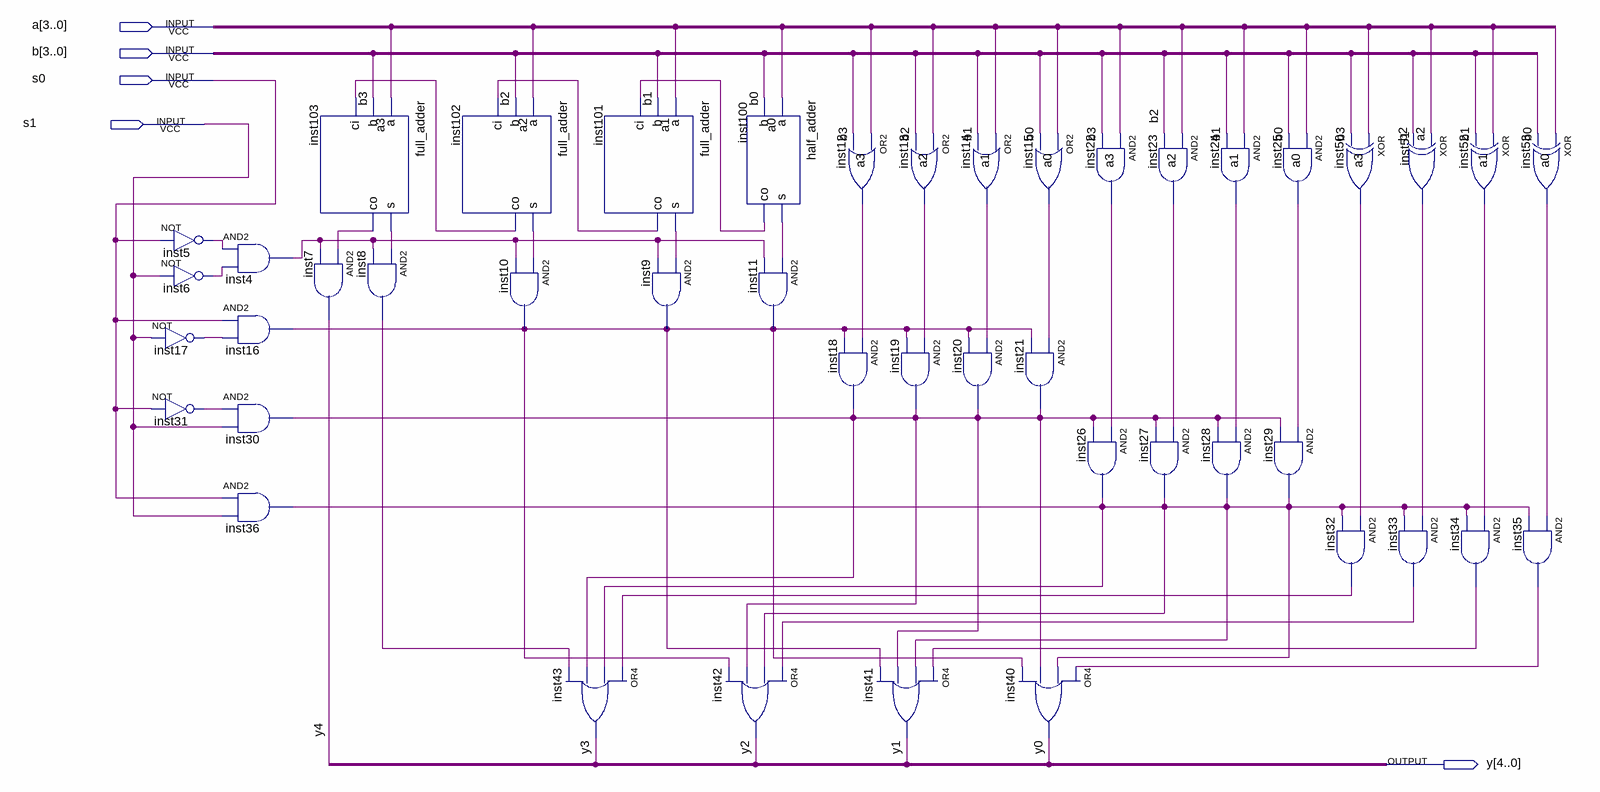
[diagram p0: schematic sheet]
// Quartus schematic simpleALU_BDF.bdf as structural Verilog: 45 symbols, 5 pins
module simpleALU_BDF (
  input  [3:0] a,
  input  [3:0] b,
  input  s0,
  input  s1,
  output [4:0] y
);

  wire inst4_out, inst5_out, inst6_out, inst8_out, inst12_out, inst13_out, inst14_out, inst15_out,
       inst16_out, inst17_out, inst22_out, inst23_out, inst24_out, inst25_out, inst30_out, inst31_out,
       inst32_out, inst33_out, inst34_out, inst35_out, inst36_out, inst50_out, inst51_out, inst52_out,
       inst53_out, inst100_co, inst100_s, inst101_co, inst101_s, inst102_co, inst102_s, inst103_co, inst103_s;

  not inst5 (inst5_out, s0);
  not inst6 (inst6_out, s1);
  not inst17 (inst17_out, s1);
  not inst31 (inst31_out, s0);
  and inst4 (inst4_out, inst5_out, inst6_out);
  and inst16 (inst16_out, s0, inst17_out);
  and inst30 (inst30_out, inst31_out, s1);
  and inst36 (inst36_out, s0, s1);
  full_adder inst103 (.a(a[3]), .b(b[3]), .ci(inst102_co), .s(inst103_s), .co(inst103_co));
  and inst7 (y[4], inst103_co, inst4_out);
  and inst8 (inst8_out, inst103_s, inst4_out);
  full_adder inst102 (.a(a[2]), .b(b[2]), .ci(inst101_co), .s(inst102_s), .co(inst102_co));
  and inst10 (inst16_out, inst102_s, inst4_out);
  or inst43 (y[3], inst32_out, inst36_out, inst30_out, inst8_out);
  full_adder inst101 (.a(a[1]), .b(b[1]), .ci(inst100_co), .s(inst101_s), .co(inst101_co));
  and inst9 (inst16_out, inst101_s, inst4_out);
  half_adder inst100 (.a(a[0]), .b(b[0]), .s(inst100_s), .co(inst100_co));
  and inst11 (inst16_out, inst100_s, inst4_out);
  or inst42 (y[2], inst33_out, inst36_out, inst30_out, inst16_out);
  or inst12 (inst12_out, a[3], b[3]);
  and inst18 (inst30_out, inst12_out, inst16_out);
  or inst13 (inst13_out, a[2], b[2]);
  and inst19 (inst30_out, inst13_out, inst16_out);
  or inst41 (y[1], inst34_out, inst36_out, inst30_out, inst16_out);
  or inst14 (inst14_out, a[1], b[1]);
  and inst20 (inst30_out, inst14_out, inst16_out);
  or inst15 (inst15_out, a[0], b[0]);
  and inst21 (inst30_out, inst15_out, inst16_out);
  or inst40 (y[0], inst35_out, inst36_out, inst30_out, inst16_out);
  and inst22 (inst22_out, a[3], b[3]);
  and inst26 (inst36_out, inst22_out, inst30_out);
  and inst23 (inst23_out, a[2], b[2]);
  and inst27 (inst36_out, inst23_out, inst30_out);
  and inst24 (inst24_out, a[1], b[1]);
  and inst28 (inst36_out, inst24_out, inst30_out);
  and inst29 (inst36_out, inst25_out, inst30_out);
  and inst25 (inst25_out, a[0], b[0]);
  xor inst50 (inst50_out, a[3], b[3]);
  and inst32 (inst32_out, inst50_out, inst36_out);
  xor inst51 (inst51_out, a[2], b[2]);
  and inst33 (inst33_out, inst51_out, inst36_out);
  xor inst52 (inst52_out, a[1], b[1]);
  and inst34 (inst34_out, inst52_out, inst36_out);
  xor inst53 (inst53_out, a[0], b[0]);
  and inst35 (inst35_out, inst53_out, inst36_out);
endmodule
